# Altium project node24.PrjPcb (part 3 of 5)

## Sheet node24-ethernet.SchDoc: Ethernet
size Tabloid; Author: Emergence Team; Engineer: asheem; Organization: Emergence; Address1: Oakland, California; Address2: a@aliengeometry.com; Address3: Black Rock City '18; Address4: OPEN SOURCE H/W; DocumentNumber: 6; Revision: Rev 0.1; SheetNumber: 6; SheetTotal: 6; Project: NODE24
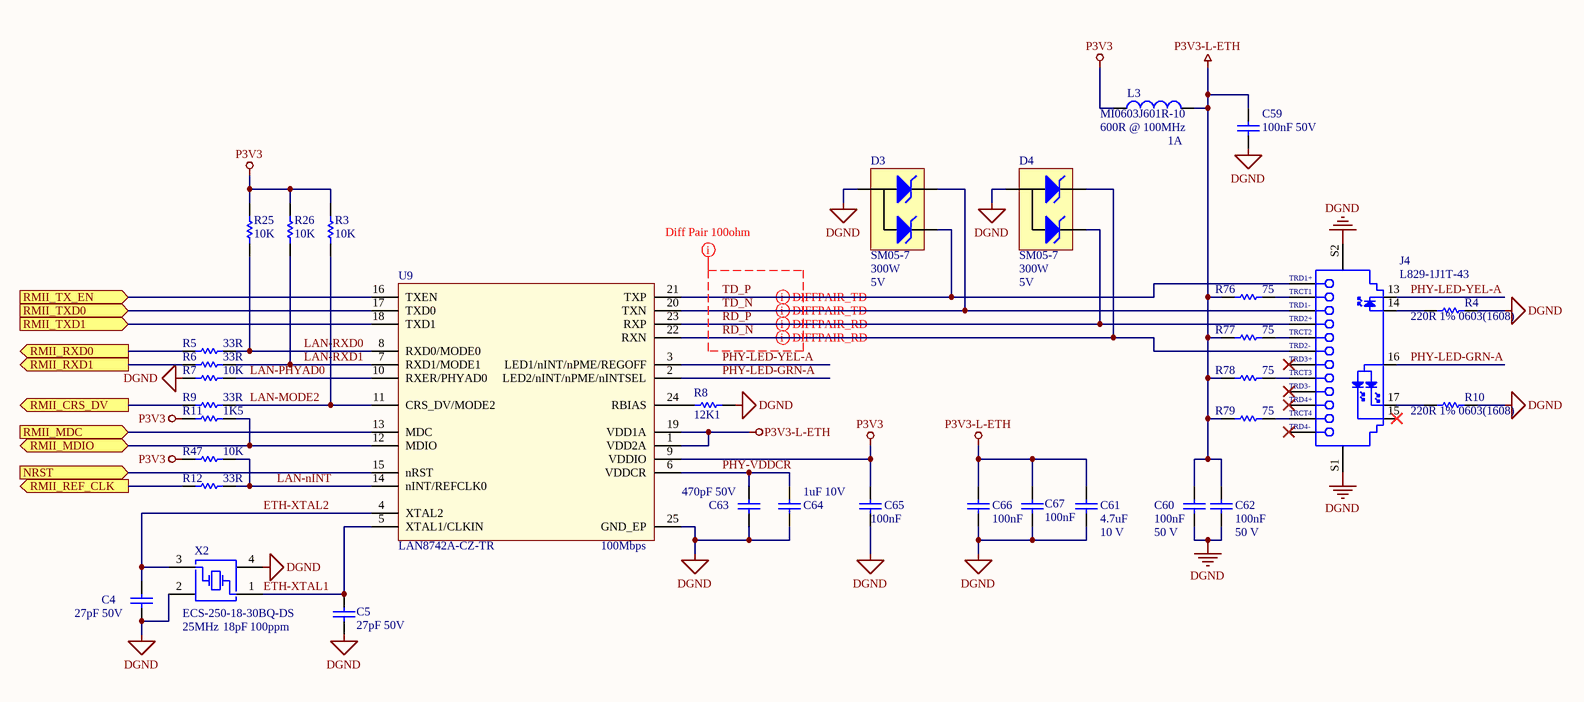
[diagram p2: node24-ethernet.SchDoc]

### Parts
C4  27pF 50V  [CAPC0603(1608)100_L]
C5  27pF 50V  [CAPC0603(1608)100_L]
C59  100nF 50V  [CAPC0603(1608)100_L]
C60  value 100nF  Rated Voltage: 50 V  [CAPC0603(1608)100_L]  (hidden comment: 100nF 50V)
C61  value 4.7uF  Rated Voltage: 10 V  [CAPC0603(1608)100_L]  (hidden comment: 4.7uF 10V)
C62  value 100nF  Rated Voltage: 50 V  [CAPC0603(1608)100_L]  (hidden comment: 100nF 50V)
C63  470pF 50V  [CAPC0603(1608)100_L]
C64  1uF 10V  [CAPC0603(1608)100_L]
C65  100nF  [CAPC0603(1608)100_L]
C66  100nF  [CAPC0603(1608)100_L]
C67  100nF  [CAPC0603(1608)100_L]
D3  Manufacturer Part Number: SM05-7  Max Power Dissipation: 300W  Reverse Standoff Voltage: 5V  [SOT-23]  (hidden comment: TVS_5V_DUAL_SOT23-3_SM05-7)
D4  Manufacturer Part Number: SM05-7  Max Power Dissipation: 300W  Reverse Standoff Voltage: 5V  [SOT-23]  (hidden comment: TVS_5V_DUAL_SOT23-3_SM05-7)
J4  L829-1J1T-43  [BELS-L829-1J1T-43_V]
L3  Manufacturer Part Number: MI0603J601R-10  Max DC Current: 1A  Impedance: 600R @ 100MHz  [0603L]  (hidden comment: BEAD_LAIRD_MI0603J601R-10)
R3  10K  [RESC0603(1608)_L]
R4  220R 1% 0603(1608)  [RESC0603(1608)_L]
R5  33R  [RESC0603(1608)_L]
R6  33R  [RESC0603(1608)_L]
R7  10K  [RESC0603(1608)_L]
R8  12K1  [RESC0603(1608)_L]
R9  33R  [RESC0603(1608)_L]
R10  220R 1% 0603(1608)  [RESC0603(1608)_L]
R11  1K5  [RESC0603(1608)_L]
R12  33R  [RESC0603(1608)_L]
R25  10K  [RESC0603(1608)_L]
R26  10K  [RESC0603(1608)_L]
R47  10K  [RESC0603(1608)_L]
R76  value 75  [RESC0603(1608)_M]  (hidden comment: 75R 1% 0603(1608))
R77  value 75  [RESC0603(1608)_M]  (hidden comment: 75R 1% 0603(1608))
R78  value 75  [RESC0603(1608)_M]  (hidden comment: 75R 1% 0603(1608))
R79  value 75  [RESC0603(1608)_M]  (hidden comment: 75R 1% 0603(1608))
U9  Data Rate: 100Mbps  [QFN24_B4X4_P0MM5_EP]  (hidden comment: LAN8742A-CZ-TR)
X2  Load Capacitance: 18pF  Frequency Stability: 100ppm  Frequency: 25MHz  Manufacturer Part Number: ECS-250-18-30BQ-DS  [XTAL_4SMD_5x3mm2]  (hidden comment: XTAL_25MHz_18PF_4SMD_100PPM_AUTOMOTIVE_ECS-250-18-30BQ-DS)

### Ports
NRST (in), RMII_CRS_DV (out), RMII_MDC (in), RMII_MDIO (bidir), RMII_REF_CLK (out), RMII_RXD0 (out), RMII_RXD1 (out), RMII_TX_EN (in), RMII_TXD0 (in), RMII_TXD1 (in)

### Nets
DGND: C4.2 C5.2 C59.1 C60.1 C61.2 C62.1 C63.1 C64.1 C65.1 C66.1 C67.1 D3.3(A) D4.3(A) J4.S1 J4.S2 R4.1 R7.2 R8.2 R10.1 U9.25(GND_EP) X2.2(CAN) X2.4(CAN)
P3V3: C65.2 L3.1 R3.2 R11.1 R25.2 R26.2 R47.2 U9.9(VDDIO)
P3V3-L-ETH: C59.2 C60.2 C61.1 C62.2 C66.2 C67.2 L3.2 R76.1 R77.1 R78.1 R79.1 U9.1(VDD2A) U9.19(VDD1A)
ETH-CRS-DV: R9.1 ; port RMII_CRS_DV
ETH-MDC: U9.13(MDC) ; port RMII_MDC
ETH-MDIO: R11.2 U9.12(MDIO) ; port RMII_MDIO
ETH-REF-CLK: R12.1 ; port RMII_REF_CLK
ETH-RXD0: R5.1 ; port RMII_RXD0
ETH-RXD1: R6.1 ; port RMII_RXD1
ETH-TX-EN: U9.16(TXEN) ; port RMII_TX_EN
ETH-TXD0: U9.17(TXD0) ; port RMII_TXD0
ETH-TXD1: U9.18(TXD1) ; port RMII_TXD1
ETH-XTAL1: C5.1 U9.5(XTAL1/CLKIN) X2.1(OSC1)
ETH-XTAL2: C4.1 U9.4(XTAL2) X2.3
LAN-MODE2: R3.1 R9.2 U9.11(CRS_DV/MODE2)
LAN-nINT: R12.2 R47.1 U9.14(nINT/REFCLK0)
LAN-PHYAD0: R7.1 U9.10(RXER/PHYAD0)
LAN-RXD0: R5.2 R25.1 U9.8(RXD0/MODE0)
LAN-RXD1: R6.2 R26.1 U9.7(RXD1/MODE1)
nRST: U9.15(nRST) ; port NRST
PHY-LED-GRN-A: J4.16 U9.2(LED2/nINT/nPME/nINTSEL)
PHY-LED-YEL-A: J4.13 U9.3(LED1/nINT/nPME/REGOFF)
PHY-VDDCR: C63.2 C64.2 U9.6(VDDCR)
RD_N: D4.1(K1) J4.6(TRD2-) U9.22(RXN)
RD_P: D4.2(K2) J4.4(TRD2+) U9.23(RXP)
TD_N: D3.1(K1) J4.3(TRD1-) U9.20(TXN)
TD_P: D3.2(K2) J4.1(TRD1+) U9.21(TXP)
NetJ4_2: J4.2(TRCT1) R76.2
NetJ4_5: J4.5(TRCT2) R77.2
NetJ4_8: J4.8(TRCT3) R78.2
NetJ4_11: J4.11(TRCT4) R79.2
NetJ4_14: J4.14 R4.2
NetJ4_17: J4.17 R10.2
NetR8_1: R8.1 U9.24(RBIAS)

Not connected (* = marked no-connect by the designer): J4 7(TRD3+)* 9(TRD3-)* 10(TRD4+)* 12(TRD4-)* 15*

### Layout directives
differential pair: RD_N, RD_P, TD_N, TD_P
rule Matched Net Lengths [Tolerance = 100mil]: RD_N, RD_P, TD_N, TD_P

### Notes on the sheet
- Title
- Size
- Date:
- Tabloid
- Number
- Engineer:
- Revision
- Sheet
- of
- File:
- SVN:

### Library data of the parts
C4 C5 = CMP-1035-00888-1: CAP 27pF 50V ±5% 0603 (1608 Metric) Thickness 1mm SMD; Case-Metric: 1608; Case-EIA: 0603; Tolerance: Â±5%; Technology: SMT; Value: 27pF; Rated Voltage: 50 V; Max Thickness: 1 mm
C59 C60 C62 C65-C67 = CMP-1035-02593-1: CAP 100nF 50V ±20% 0603 (1608 Metric) Thickness 1mm SMD; Tolerance: Â±20%; Case-EIA: 0603; Case-Metric: 1608; Max Thickness: 1 mm; Technology: SMT
  C59 C65-C67: Value: 100nF; Rated Voltage: 50 V
C61 = CMP-1035-02787-1: CAP 4.7uF 10V ±20% 0603 (1608 Metric) Thickness 1mm SMD; Case-EIA: 0603; Case-Metric: 1608; Tolerance: Â±20%; Max Thickness: 1 mm; Technology: SMT
C63 = CMP-1035-01677-1: CAP 470pF 50V ±20% 0603 (1608 Metric) Thickness 1mm SMD; Case-Metric: 1608; Tolerance: Â±20%; Case-EIA: 0603; Technology: SMT; Value: 470pF; Max Thickness: 1 mm; Rated Voltage: 50 V
C64 = CMP-1035-02734-1: CAP 1uF 10V ±20% 0603 (1608 Metric) Thickness 1mm SMD; Tolerance: Â±20%; Case-EIA: 0603; Case-Metric: 1608; Technology: SMT; Value: 1uF; Max Thickness: 1 mm; Rated Voltage: 10 V
D3 D4 = TVS_5V_DUAL_SOT23-3_SM05-7: TVS DIODE 5VWM 20.6VC SOT23; Manufacturer: Diodes; Direction: Unidirectional,Bidirectional; Element Configuration: Common Anode; Capacitance: 230pF; Number of Unidirectional Channels: 2; Clamping Voltage: 20.6V; Power Line Protection: No; Polarity: Unidirectional; Breakdown Voltage: 7.3V; Leakage Current: 10uA; ESD Protection: Yes; Test Current: 1mA; Peak Pulse Current: 17A; Min Breakdown Voltage: 6.2V; Supplier 1: Digi-Key; Stock 1: 20844; Pricing 1: 1=0.46, 10=0.341, 100=0.1932, 500=0.12792, 1000=0.09808 (USD); Mount: Surface Mount; Case/Package: SOT-23; Number of Pins: 3; Contact Plating: Tin,Matte; Min Operating Temperature: -55°C; Max Operating Temperature: 150°C; Package Quantity: 3000; Packaging: Tape and Reel; Peak Pulse Power: 300W; Termination: SMD/SMT; Working Voltage: 5V; Max Reverse Leakage Current: 10uA; Length: 2.9mm; Height: 1mm; Width: 1.3mm; Depth: 1.3mm; Radiation Hardening: No; Lead Free: Lead Free; ComponentLink1URL: https://datasheet.ciiva.com/333/ds31828-333314.pdf; ComponentLink1Description: https://datasheet.ciiva.com/333/ds31828-333314.pdf; ComponentLink2URL: https://datasheet.ciiva.com/15186/getdatasheetpartid-375729-15186470.pdf; ComponentLink2Description: https://datasheet.ciiva.com/15186/getdatasheetpartid-375729-15186470.pdf; ComponentLink3URL: https://datasheet.ciiva.com/25956/ds31828-25956699.pdf; ComponentLink3Description: https://datasheet.ciiva.com/25956/ds31828-25956699.pdf; ComponentLink4URL: https://datasheet.ciiva.com/13083/ds31828-89171-13083151.pdf; ComponentLink4Description: https://datasheet.ciiva.com/13083/ds31828-89171-13083151.pdf; Supplier Part Number 1: SM05-7DIDKR-ND
J4 = CMP-1715-00001-1: Gigabit MagJack(R) Ultra Low Profile, 10/100/1000 Base-T, 19-Pin THD, RoHS, Tray; Width: 24.13 mm; RoHSCompliant: True; PartNumber: L829-1J1T-43; Case/Package: Metal; Mount: Through Hole; ComponentLink1Description: Manufacturer URL; Height: 11.3 mm; Package Quantity: 60; Packaging: Tray; Length: 17.78 mm; PackageDescription: 19-Pin Through Hole Device, Body 23.94 x 17.58 mm, Pitch 2.03 mm; ComponentLink2URL: http://belfuse.com/pdfs/L829-1J1T-43.pdf; ComponentLink1URL: http://belfuse.com/ethernet/; Mounting Technology: Through Hole; DatasheetVersion: Rev. G; Pins: 8; ComponentLink2Description: Datasheet
L3 = BEAD_LAIRD_MI0603J601R-10: FERRITE BEAD 600 OHM 0603; Manufacturer: Laird; Number of Lines: 1; DC Resistance (DCR): 200mR; Test Frequency: 100MHz; Supplier 1: Digi-Key; Stock 1: 1193128; Pricing 1: 1=0.18, 10=0.148, 25=0.1152, 50=0.0952, 100=0.0822, 250=0.06572, 500=0.05914, 1000=0.04929 (USD); Mount: Surface Mount; Case/Package: 0603; Weight: 0.002oz; Case Code (Metric): 1608; Case Code (Imperial): 0603; Contact Plating: Tin,Matte; Core Material: Ferrite; Material: Ferrite; Min Operating Temperature: -40°C; Max Operating Temperature: 125°C; Packaging: Tape and Reel; Package Quantity: 1; Max Current Rating: 1A; Termination: SMD/SMT; Frequency: 100MHz; Current Rating: 1A; Length: 1.6mm; Height: 0.8mm; Width: 0.031inch; Depth: 0.8mm; Lead Free: Lead Free; REACH SVHC: Unknown; ComponentLink1URL: https://datasheet.ciiva.com/3082/mi0603j601r-10-a2-vp-3082208.pdf; ComponentLink1Description: https://datasheet.ciiva.com/3082/mi0603j601r-10-a2-vp-3082208.pdf; ComponentLink2URL: https://datasheet.ciiva.com/22650/1685984-22650402.pdf; ComponentLink2Description: https://datasheet.ciiva.com/22650/1685984-22650402.pdf; ComponentLink3URL: https://datasheet.ciiva.com/1013/mi0603j601r-10-1013257.pdf; ComponentLink3Description: https://datasheet.ciiva.com/1013/mi0603j601r-10-1013257.pdf; Supplier Part Number 1: 240-2371-6-ND
R3 R7 R25 R26 R47 = CMP-1012-00623-1: 10K 0.1W 1% 0603 (1608 Metric)  SMD; Value: 10000.00 Ohm; Case-EIA: 0603; Case-Metric: 1608; Power: 0.1 W; Tolerance: 1 %; Technology: SMT
R4 R10 = CMP-1012-00433-1: 220R 0.1W 1% 0603 (1608 Metric)  SMD; Value: 220.00 Ohm; Case-EIA: 0603; Case-Metric: 1608; Technology: SMT; Tolerance: 1 %; Power: 0.1 W
R5 R6 R9 R12 = CMP-1012-00341-1: 33R 0.1W 1% 0603 (1608 Metric)  SMD; Value: 33.00 Ohm; Case-EIA: 0603; Case-Metric: 1608; Tolerance: 1 %; Technology: SMT; Power: 0.1 W
R8 = CMP-1012-00632-1: 12K1 0.1W 1% 0603 (1608 Metric)  SMD; Case-Metric: 1608; Case-EIA: 0603; Value: 12100.00 Ohm; Power: 0.1 W; Technology: SMT; Tolerance: 1 %
R11 = CMP-1012-00528-1: 1K5 0.1W 1% 0603 (1608 Metric)  SMD; Case-EIA: 0603; Value: 1500.00 Ohm; Case-Metric: 1608; Power: 0.1 W; Technology: SMT; Tolerance: 1 %
R76-R79 = CMP-1012-00383-1: 75R 0.1W 1% 0603 (1608 Metric)  SMD; Case-EIA: 0603; Case-Metric: 1608; Power: 0.1 W; Technology: SMT; Tolerance: 1 %
U9 = IC_INTERFACE_ETHERNET_PHY_LAN8742A-CZ-TR: LAN8742A-CZ-TR - Small Footprint RMII 10/100 Ethernet, Transceiver with HP Auto-MDIX and flexPWR Technology SQFN-24; Manufacturer: Microchip; Max Supply Voltage: 3.3V; Min Supply Voltage: 1.8V; Number of Transceivers: 1; Supplier 1: Digi-Key; Stock 1: 3390; Pricing 1: 1=1.24, 25=1.03 (USD); Mount: Surface Mount; Case/Package: QFN; Number of Pins: 24; Min Operating Temperature: 0°C; Max Operating Temperature: 85°C; Package Quantity: 5000; Packaging: Tape and Reel; Radiation Hardening: No; ComponentLink1URL: https://datasheet.ciiva.com/29882/8742a-29882620.pdf; ComponentLink1Description: https://datasheet.ciiva.com/29882/8742a-29882620.pdf; Supplier Part Number 1: LAN8742A-CZ-CT-ND; Manufacturer Part Number: LAN8742A-CZ-TR
X2 = XTAL_25MHz_18PF_4SMD_100PPM_AUTOMOTIVE_ECS-250-18-30BQ-DS: Crystals 25.000MHz 18pF 100ppm -40 to 125C; Manufacturer: ECS International; ESR (Equivalent Series Resistance): 30R; Frequency Tolerance: 30ppm; Supplier 1: Digi-Key; Stock 1: 1363; Pricing 1: 1=1.2, 10=1.063, 50=0.9934, 100=0.8778, 500=0.8316 (USD); Mount: Surface Mount; Case/Package: SMD/SMT; Min Operating Temperature: -40°C; Max Operating Temperature: 125°C; Packaging: Tape and Reel; Package Quantity: 1000; Termination: SMD/SMT; Tolerance: 30ppm; Length: 0.197inch; Height: 0.033inch; Width: 3.2mm; ComponentLink1URL: https://datasheet.ciiva.com/18649/ecx-53bq-18649724.pdf; ComponentLink1Description: https://datasheet.ciiva.com/18649/ecx-53bq-18649724.pdf; ComponentLink2URL: https://datasheet.ciiva.com/18649/ecx-53bq-18649725.pdf; ComponentLink2Description: https://datasheet.ciiva.com/18649/ecx-53bq-18649725.pdf; ComponentLink3URL: https://datasheet.ciiva.com/18649/ecx-53bq-18649726.pdf; ComponentLink3Description: https://datasheet.ciiva.com/18649/ecx-53bq-18649726.pdf; Supplier Part Number 1: XC2003CT-ND

## Sheet node24-power.SchDoc: Power Management
size Tabloid; Author: Emergence Team; Engineer: asheem; Organization: Emergence; Address1: Oakland, California; Address2: a@aliengeometry.com; Address3: Black Rock City '18; Address4: OPEN SOURCE H/W; DocumentNumber: 5; Revision: Rev 0.1; SheetNumber: 5; SheetTotal: 6; Project: NODE24
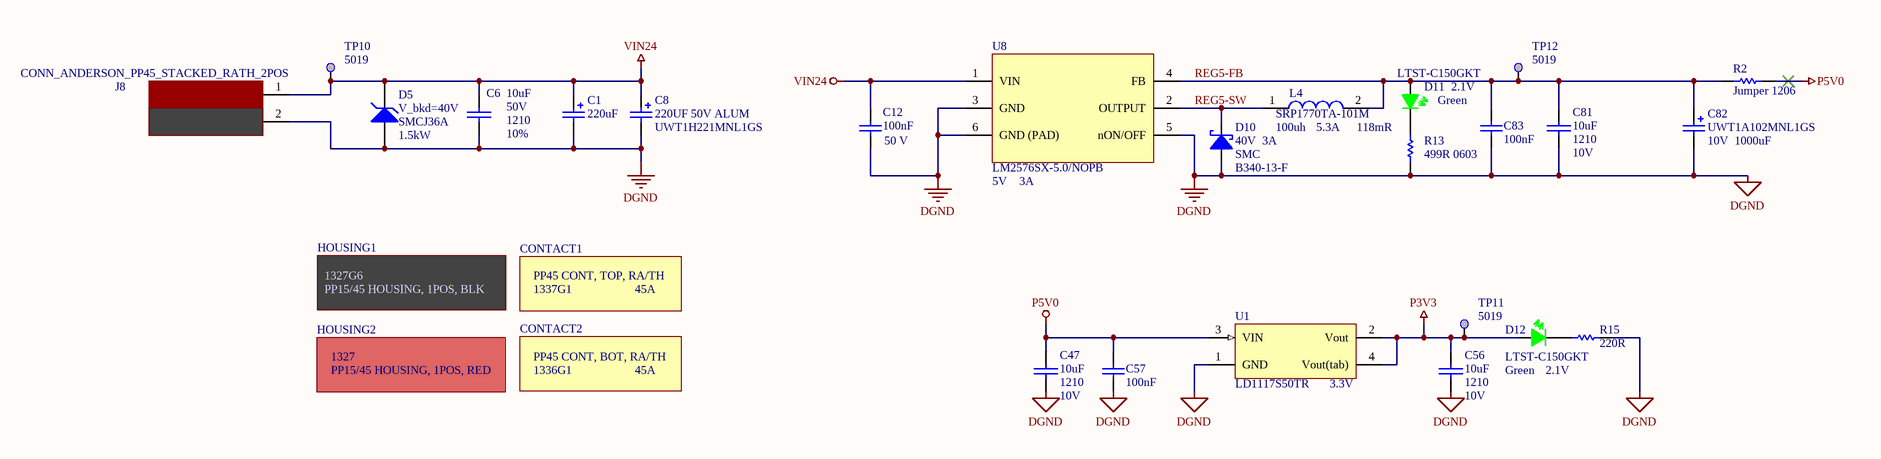
[diagram p3: node24-power.SchDoc]

### Parts
C1  Capacitance: 220uF  [CAPAE_D10_BH10MM3]  (hidden comment: 220UF ALUM 10MM)
C6  Tolerance: 10%  Voltage Rating: 50V  Capacitance: 10uF  Case/Package: 1210  [CAP1210]  (hidden comment: CAP_CER_10UF_50V_1210_GRJ32ER71H106KE11L)
C8  220UF 50V ALUM  Manufacturer Part Number: UWT1H221MNL1GS  [CAPAE_D10_BH10MM3]
C12  100nF  Rated Voltage: 50 V  [CAPC0603(1608)100_L]
C47  Capacitance: 10uF  Case/Package: 1210  Voltage Rating: 10V  [1210C]  (hidden comment: CAP_CER_10UF_1210_CL32B106KPINNNE)
C56  Capacitance: 10uF  Case/Package: 1210  Voltage Rating: 10V  [1210C]  (hidden comment: CAP_CER_10UF_1210_CL32B106KPINNNE)
C57  100nF  [CAPC0603(1608)100_L]
C81  Capacitance: 10uF  Case/Package: 1210  Voltage Rating: 10V  [1210C]  (hidden comment: CAP_CER_10UF_1210_CL32B106KPINNNE)
C82  Manufacturer Part Number: UWT1A102MNL1GS  Voltage: 10V  Capacitance: 1000uF  [CAPAE_D10_BH10MM3]  (hidden comment: CAP_ALUM_10V_1000UF_10MM_UWT1A102MNL1GS)
C83  100nF  [CAPC0603(1608)100_L]
CONTACT1  Current Rating: 45A  Manufacturer Part Number: 1337G1  Parameter 1: PP45 CONT, TOP, RA/TH  (hidden comment: CONN_ANDERSON_CONTACT_PP45_RATH_BOTTOM_1337G1)
CONTACT2  Parameter 1: PP45 CONT, BOT, RA/TH  Current Rating: 45A  Manufacturer Part Number: 1336G1  (hidden comment: CONN_ANDERSON_CONTACT_PP45_RATH_TOP_1336G1)
D5  Power Dissipation: 1.5kW  Manufacturer Part Number: SMCJ36A  Breakdown Voltage: V_bkd=40V  [DIODE_SMC]  (hidden comment: TVS_36V_1500W_SMC_SMCJ36A)
D10  Manufacturer Part Number: B340-13-F  Case/Package: SMC  Max Reverse Voltage (DC): 40V  Current: 3A  [DIODE_SMC]  (hidden comment: DIODE_SCHOTTKY_40V_3A_SMC_DIO_B340-13-F)
D11  Forward Voltage: 2.1V  Illumination Colour: Green  Manufacturer Part Number: LTST-C150GKT  [LED_1206]  (hidden comment: LED_LITEON_GREEN_1206_LTST-C150GKT)
D12  Forward Voltage: 2.1V  Illumination Colour: Green  Manufacturer Part Number: LTST-C150GKT  [LED_1206]  (hidden comment: LED_LITEON_GREEN_1206_LTST-C150GKT)
HOUSING1  Manufacturer Part Number: 1327G6  Parameter 1: PP15/45 HOUSING, 1POS, BLK  (hidden comment: CONN_ANDERSON_HOUSING_PP45/15_BLACK_1327G6)
HOUSING2  Manufacturer Part Number: 1327  Parameter 1: PP15/45 HOUSING, 1POS, RED  (hidden comment: CONN_ANDERSON_HOUSING_PP45/15_RED_1327)
J8  CONN_ANDERSON_PP45_STACKED_RATH_2POS  [CONN_ANDERSON_POWERPOLE_45_HOUSING_STACKED_RATH]
L4  Inductance: 100uh  DC Resistance (DCR): 118mR  Manufacturer Part Number: SRP1770TA-101M  Current Rating: 5.3A  [IND_17MM_SMT]  (hidden comment: IND_100UH_5A3_SRP1770TA-101M)
R2  Jumper 1206  [RESC1206(3216)_L]
R13  499R 0603  [RESC0603(1608)_L]
R15  220R  [RESC0603(1608)_L]
TP10  Manufacturer Part Number: 5019  [TEST_POINT_KEYSTONE_5019]  (hidden comment: TEST_POINT_KEYSTONE_5019_SMT)
TP11  Manufacturer Part Number: 5019  [TEST_POINT_KEYSTONE_5019]  (hidden comment: TEST_POINT_KEYSTONE_5019_SMT)
TP12  Manufacturer Part Number: 5019  [TEST_POINT_KEYSTONE_5019]  (hidden comment: TEST_POINT_KEYSTONE_5019_SMT)
U1  LD1117S50TR  Max Output Voltage: 3.3V  [SOT-223]
U8  Manufacturer Part Number: LM2576SX-5.0/NOPB  Output Voltage: 5V  Max Output Current: 3A  [D2PAK_TO-263-6]  (hidden comment: DCDC_TI_BUCK_REG_5V_3A_40VIN_D2PAK_LM2576SX-5.0/NOPB)

### Nets
DGND: C1.2 C6.2 C8.2 C12.2 C47.2 C56.2 C57.2 C81.2 C82.2 C83.2 D5.1(K) D10.1(A) J8.2 R13.2 R15.1 U1.1(GND) U8.3(GND) U8.5(nON/OFF) U8.6(GND_(PAD))
P3V3: C56.1 D12.1 TP11.1 U1.2(Vout) U1.4(Vout(tab))
P5V0: C47.1 C57.1 R2.2 U1.3(VIN)
VIN24: C1.1 C6.1 C8.1 C12.1 D5.2(A) J8.1 TP10.1 U8.1(VIN)
REG5-FB: C81.1 C82.1 C83.1 D11.1 L4.2 R2.1 TP12.1 U8.4(FB)
REG5-SW: D10.2(K) L4.1 U8.2(OUTPUT)
NetD11_2: D11.2 R13.1
NetD12_2: D12.2 R15.2

### Notes on the sheet
- Title
- Size
- Date:
- Tabloid
- Number
- Engineer:
- Revision
- Sheet
- of
- File:
- SVN:

### Library data of the parts
C1 C8 = CAP_ALUM_220UF_10MM_UWT1H221MNL1GS: CAP ALUM 220UF 20% 50V SMD; Manufacturer: Nichicon; Dielectric Material: Aluminium; Ripple Current: 220mA; Leakage Current: 3uA; Life (Hours): 1000Hour; Dissipation Factor: 0.14%; Supplier 1: Digi-Key; Stock 1: 57237; Pricing 1: 1=0.66, 10=0.464, 100=0.3058 (USD); Mount: Surface Mount; Case/Package: SMD/SMT; Number of Pins: 2; Temperature: -55~105C; Tolerance: 20%; Package Quantity: 500; Voltage Rating: 50V; Voltage Rating (DC): 50V; Packaging: Tape and Reel; Ripple Current (AC): 220mA; Termination: SMD/SMT; Voltage: 50V; Diameter: 10mm; Length: 10mm; Height: 10mm; Height - Seated (Max): 0.394inch; Lead Pitch: 4.5mm; Radiation Hardening: No; REACH SVHC: No SVHC; Lead Free: Lead Free; ComponentLink1URL: https://datasheet.ciiva.com/7781/e-wt-7781462.pdf; ComponentLink1Description: https://datasheet.ciiva.com/7781/e-wt-7781462.pdf; ComponentLink2URL: https://datasheet.ciiva.com/11686/e-wt-11686311.pdf; ComponentLink2Description: https://datasheet.ciiva.com/11686/e-wt-11686311.pdf; ComponentLink3URL: https://datasheet.ciiva.com/97/e-wt-97496.pdf; ComponentLink3Description: https://datasheet.ciiva.com/97/e-wt-97496.pdf; ComponentLink4URL: https://datasheet.ciiva.com/97/e-wt-97497.pdf; ComponentLink4Description: https://datasheet.ciiva.com/97/e-wt-97497.pdf; ComponentLink5URL: https://datasheet.ciiva.com/97/e-wt-97498.pdf; ComponentLink5Description: https://datasheet.ciiva.com/97/e-wt-97498.pdf; ComponentLink6URL: https://datasheet.ciiva.com/28458/1910938-28458474.pdf; ComponentLink6Description: https://datasheet.ciiva.com/28458/1910938-28458474.pdf; ComponentLink7URL: https://datasheet.ciiva.com/17526/e-wt-17526124.pdf; ComponentLink7Description: https://datasheet.ciiva.com/17526/e-wt-17526124.pdf; ComponentLink8URL: https://datasheet.ciiva.com/16502/e-wt-16502942.pdf; ComponentLink8Description: https://datasheet.ciiva.com/16502/e-wt-16502942.pdf; Supplier Part Number 1: 493-2228-6-ND
  C1: Manufacturer Part Number: UWT1H221MNL1GS
  C8: Capacitance: 220uF
C6 = CAP_CER_10UF_50V_1210_GRJ32ER71H106KE11L: 10µF 50V Ceramic Capacitor X7R 1210 (3225 Metric) 0.126" L x 0.098" W (3.20mm x 2.50mm); Manufacturer: Murata; Supplier 1: Digi-Key; Manufacturer Part Number: GRJ32ER71H106KE11L; Stock 1: 10000; Pricing 1: 1=1.03, 10=0.785, 100=0.5615, 500=0.4347 (USD); Mount: Surface Mount; Case Code (Metric): 3225; Case Code (Imperial): 1210; Min Operating Temperature: -55°C; Max Operating Temperature: 125°C; Packaging: Tape and Reel; Length: 0.126inch; Width: 0.098inch; Thickness: 0.11inch; ComponentLink1URL: http://search.murata.co.jp/Ceramy/image/img/A01X/partnumbering_e_01.pdf; ComponentLink1Description: http://search.murata.co.jp/Ceramy/image/img/A01X/partnumbering_e_01.pdf; ComponentLink2URL: https://www.murata.com/~/media/webrenewal/support/library/catalog/products/k70e.ashx; ComponentLink2Description: https://www.murata.com/~/media/webrenewal/support/library/catalog/products/k70e.ashx; Supplier Part Number 1: 490-10961-1-ND
C12 C57 C83 = CMP-1035-02593-1: as C59 on sheet node24-ethernet; Max Thickness: 1 mm; Value: 100nF; Technology: SMT
  C57 C83: Rated Voltage: 50 V
C47 C56 C81 = CAP_CER_10UF_1210_CL32B106KPINNNE: Cap Ceramic 10uF 10V X7R 10% SMD 1210 125C Embossed T/R; Manufacturer: Samsung; Supplier 1: Digi-Key; Manufacturer Part Number: CL32B106KPINNNE; Stock 1: 13080; Pricing 1: 1=0.36, 10=0.252, 100=0.1509, 500=0.1132, 1000=0.09559 (USD); Mount: Surface Mount; Case Code (Metric): 3225; Case Code (Imperial): 1210; Min Operating Temperature: -55°C; Max Operating Temperature: 125°C; Tolerance: 10%; Dielectric: X7R; Package Quantity: 2000; Packaging: Tape and Reel; Voltage Rating (DC): 10V; Length: 3.2mm; Height: 2mm; Depth: 2.5mm; Width: 0.098inch; Thickness: 0.087inch; Radiation Hardening: No; Lead Free: Lead Free; ComponentLink1URL: https://datasheet.ciiva.com/25792/cl32b106kpinnne-25792065.pdf; ComponentLink1Description: https://datasheet.ciiva.com/25792/cl32b106kpinnne-25792065.pdf; ComponentLink2URL: https://datasheet.ciiva.com/16437/cl05b104kq5nnnc-16437173.pdf; ComponentLink2Description: https://datasheet.ciiva.com/16437/cl05b104kq5nnnc-16437173.pdf; Supplier Part Number 1: 1276-3326-6-ND
C82 = CAP_ALUM_10V_1000UF_10MM_UWT1A102MNL1GS: CAP ALUM 1000UF 20% 10V SMD; Manufacturer: Nichicon; Dielectric Material: Aluminium; Ripple Current: 310mA; Leakage Current: 100uA; Life (Hours): 1000Hour; Lead Diameter: 1.1mm; Supplier 1: Digi-Key; Stock 1: 21953; Pricing 1: 1=0.66, 10=0.469, 100=0.3091 (USD); Mount: Surface Mount,PCB; Case/Package: Radial; Number of Pins: 2; Contact Plating: Tin; Min Operating Temperature: -55°C; Max Operating Temperature: 105°C; Tolerance: 20%; Packaging: Tape and Reel; Package Quantity: 500; Voltage Rating: 10V; Ripple Current (AC): 310mA; Voltage Rating (DC): 10V; Termination: SMD/SMT; Diameter: 10mm; Length: 10mm; Height: 10mm; Lead Pitch: 4.5mm; Height - Seated (Max): 0.394inch; Radiation Hardening: No; REACH SVHC: No SVHC; Lead Free: Lead Free; ComponentLink1URL: https://datasheet.ciiva.com/97/e-wt-97505.pdf; ComponentLink1Description: https://datasheet.ciiva.com/97/e-wt-97505.pdf; ComponentLink2URL: https://datasheet.ciiva.com/30522/getdatasheetpartid-388152-30522193.pdf; ComponentLink2Description: https://datasheet.ciiva.com/30522/getdatasheetpartid-388152-30522193.pdf; ComponentLink3URL: https://datasheet.ciiva.com/97/e-wt-97506.pdf; ComponentLink3Description: https://datasheet.ciiva.com/97/e-wt-97506.pdf; ComponentLink4URL: https://datasheet.ciiva.com/97/e-wt-97507.pdf; ComponentLink4Description: https://datasheet.ciiva.com/97/e-wt-97507.pdf; ComponentLink5URL: https://datasheet.ciiva.com/11776/0900766b80fa3a91-11776933.pdf; ComponentLink5Description: https://datasheet.ciiva.com/11776/0900766b80fa3a91-11776933.pdf; ComponentLink6URL: https://datasheet.ciiva.com/7793/e-wt-7793502.pdf; ComponentLink6Description: https://datasheet.ciiva.com/7793/e-wt-7793502.pdf; ComponentLink7URL: https://datasheet.ciiva.com/46384/1910938-46384607.pdf; ComponentLink7Description: https://datasheet.ciiva.com/46384/1910938-46384607.pdf; Supplier Part Number 1: 493-2171-6-ND
CONTACT1 = CONN_ANDERSON_CONTACT_PP45_RATH_BOTTOM_1337G1: Heavy Duty Power Connectors PCB45 HORIZ (TOP) RA LP CONT.; Manufacturer: Anderson Power; Voltage Rating: 250V; Gender: Female; Supplier 1: Mouser; Stock 1: 13219; Pricing 1: 1=0.58, 10=0.58, 50=0.467, 100=0.43, 1000=0.38, 10000=0.38 (USD); Mount: Through Hole; Contact Material: Copper,Copper Alloy; Contact Plating: Tin; Termination: Through Hole; REACH SVHC: No SVHC; ComponentLink1URL: https://datasheet.ciiva.com/18408/70162076-18408970.pdf; ComponentLink1Description: https://datasheet.ciiva.com/18408/70162076-18408970.pdf; Supplier Part Number 1: 879-1337G1
CONTACT2 = CONN_ANDERSON_CONTACT_PP45_RATH_TOP_1336G1: Heavy Duty Power Connectors PCB45 HORIZ. (BOT) RA LP CONT.; Manufacturer: Anderson Power; Voltage Rating: 250V; Gender: Female; Supplier 1: Mouser; Stock 1: 32882; Pricing 1: 1=0.57, 10=0.57, 50=0.501, 100=0.448, 1000=0.373, 10000=0.373 (USD); Mount: Through Hole; Contact Material: Copper,Copper Alloy; Contact Plating: Tin; Termination: Through Hole; REACH SVHC: No SVHC; ComponentLink1URL: https://datasheet.ciiva.com/18408/70162076-18408966.pdf; ComponentLink1Description: https://datasheet.ciiva.com/18408/70162076-18408966.pdf; Supplier Part Number 1: 879-1336G1
D5 = TVS_36V_1500W_SMC_SMCJ36A: TVS DIODE 36VWM 58.1VC SMC; Manufacturer: Littelfuse; Direction: Unidirectional; Reverse Breakdown Voltage: 40V; Operating Supply Voltage: 36V; Max Surge Current: 25.9A; Number of Elements: 1; Clamping Voltage: 58.1V; Power Line Protection: No; Test Current: 1mA; Max Breakdown Voltage: 44.2V; Max Reverse Leakage Current: 1uA; Max Power Dissipation: 6.5W; Element Configuration: Single; Supplier 1: Digi-Key; Stock 1: 19790; Pricing 1: 1=0.61, 10=0.513, 25=0.4488, 100=0.3846, 250=0.33332, 500=0.28206, 1000=0.21795 (USD); Mount: Surface Mount; Case/Package: SMC; Number of Pins: 2; Min Operating Temperature: -65°C; Max Operating Temperature: 150°C; Package Quantity: 3000; Packaging: Tape and Reel; Number of Channels: 1; Polarity: Unidirectional; Peak Pulse Power: 1.5kW; Termination: SMD/SMT; Number of Unidirectional Channels: 1; Reverse Standoff Voltage: 36V; Min Breakdown Voltage: 40V; Peak Pulse Current: 25.9A; Leakage Current: 1uA; Voltage Rating (DC): 36V; Length: 7.11mm; Height: 2.417mm; Width: 6.22mm; Radiation Hardening: No; REACH SVHC: No SVHC; Lead Free: Lead Free; ComponentLink1URL: https://datasheet.ciiva.com/14162/smcj-eng-ds-14162005.pdf; ComponentLink1Description: https://datasheet.ciiva.com/14162/smcj-eng-ds-14162005.pdf; ComponentLink2URL: https://datasheet.ciiva.com/26943/getdatasheetpartid-214039-26943381.pdf; ComponentLink2Description: https://datasheet.ciiva.com/26943/getdatasheetpartid-214039-26943381.pdf; ComponentLink3URL: https://datasheet.ciiva.com/4510/littelfuse-tvs-diode-smcj-62645-4510614.pdf; ComponentLink3Description: https://datasheet.ciiva.com/4510/littelfuse-tvs-diode-smcj-62645-4510614.pdf; ComponentLink4URL: https://datasheet.ciiva.com/16487/littelfuse-tvs-diode-smcj-16487798.pdf; ComponentLink4Description: https://datasheet.ciiva.com/16487/littelfuse-tvs-diode-smcj-16487798.pdf; ComponentLink5URL: https://datasheet.ciiva.com/8062/littelfuse-tvs-diode-smcj-8062391.pdf; ComponentLink5Description: https://datasheet.ciiva.com/8062/littelfuse-tvs-diode-smcj-8062391.pdf; ComponentLink6URL: https://datasheet.ciiva.com/332/littelfuse-tvs-diode-smcj-datasheet-pdf-332153.pdf; ComponentLink6Description: https://datasheet.ciiva.com/332/littelfuse-tvs-diode-smcj-datasheet-pdf-332153.pdf; ComponentLink7URL: https://datasheet.ciiva.com/332/littelfuse-tvs-diode-smcj-datasheet-pdf-332154.pdf; ComponentLink7Description: https://datasheet.ciiva.com/332/littelfuse-tvs-diode-smcj-datasheet-pdf-332154.pdf; ComponentLink8URL: https://datasheet.ciiva.com/332/littelfuse-tvs-diode-smcj-datasheet-pdf-332155.pdf; ComponentLink8Description: https://datasheet.ciiva.com/332/littelfuse-tvs-diode-smcj-datasheet-pdf-332155.pdf; ComponentLink9URL: https://datasheet.ciiva.com/46385/607636-46385086.pdf; ComponentLink9Description: https://datasheet.ciiva.com/46385/607636-46385086.pdf; Supplier Part Number 1: SMCJ36ALFCT-ND
D10 = DIODE_SCHOTTKY_40V_3A_SMC_DIO_B340-13-F: DIODE SCHOTTKY 40V 3A SMC; Manufacturer: Diodes; Peak Reverse Current: 500uA; Forward Voltage: 500mV; Max Forward Surge Current (Ifsm): 100A; Element Configuration: Single; Polarity: Standard; Capacitance: 250pF; Supplier 1: Digi-Key; Stock 1: 14507; Pricing 1: 1=0.39, 10=0.32, 100=0.2175, 500=0.16316, 1000=0.12236 (USD); Mount: Surface Mount; Number of Pins: 2; Weight: 0.007408oz; Min Operating Temperature: -55°C; Max Operating Temperature: 125°C; Package Quantity: 3000; Packaging: Tape and Reel; Forward Current: 3A; Average Rectified Current: 3A; Max Repetitive Reverse Voltage (Vrrm): 40V; Peak Non-Repetitive Surge Current: 100A; Termination: SMD/SMT; Voltage Rating (DC): 40V; Current Rating: 3A; Output Current: 3A; Voltage: 40V; Length: 7.11mm; Height: 2.5mm; Width: 6.22mm; Radiation Hardening: No; REACH SVHC: No SVHC; Lead Free: Lead Free; ComponentLink1URL: https://datasheet.ciiva.com/914/ds30923-914112.pdf; ComponentLink1Description: https://datasheet.ciiva.com/914/ds30923-914112.pdf; ComponentLink2URL: https://datasheet.ciiva.com/16291/ds13005-16291142.pdf; ComponentLink2Description: https://datasheet.ciiva.com/16291/ds13005-16291142.pdf; ComponentLink3URL: https://datasheet.ciiva.com/26949/getdatasheetpartid-116064-26949351.pdf; ComponentLink3Description: https://datasheet.ciiva.com/26949/getdatasheetpartid-116064-26949351.pdf; Supplier Part Number 1: B340-FDIDKR-ND
D11 D12 = LED_LITEON_GREEN_1206_LTST-C150GKT: LED GREEN CLEAR 1206 SMD; Manufacturer: Vishay Lite-On; Lens Colour: Clear,Colorless; Max Power Dissipation: 100mW; Luminous Intensity: 6mcd; Forward Current: 30mA; Viewing Angle: 130°; Lens Style: Clear,Diffused,Colorless,Rectangular; Dominant Wavelength: 569nm; Test Current: 10mA; Number of Elements: 1; Wavelength: 565nm; Reverse Voltage: 5V; Supplier 1: Digi-Key; Stock 1: 0; Mount: Surface Mount; Case/Package: 1206; Number of Pins: 2; Colour: Green; Case Code (Metric): 3216; Case Code (Imperial): 1206; Min Operating Temperature: -55°C; Max Operating Temperature: 85°C; Packaging: Tape and Reel; Package Quantity: 1; Power Rating: 100mW; Lens Transparency: Clear; Power Dissipation: 100mW; Number of LEDs: 1; Length: 3.2mm; Height: 1.1mm; Width: 1.6mm; Depth: 1.6mm; Radiation Hardening: No; Lead Free: Lead Free; ComponentLink1URL: https://datasheet.ciiva.com/2110/ltst-c150gkt-2110032.pdf; ComponentLink1Description: https://datasheet.ciiva.com/2110/ltst-c150gkt-2110032.pdf; ComponentLink2URL: https://datasheet.ciiva.com/12400/lite-on-ltst-c150gkt-187412-12400912.pdf; ComponentLink2Description: https://datasheet.ciiva.com/12400/lite-on-ltst-c150gkt-187412-12400912.pdf; ComponentLink3URL: https://datasheet.ciiva.com/11775/0900766b80dc0263-11775637.pdf; ComponentLink3Description: https://datasheet.ciiva.com/11775/0900766b80dc0263-11775637.pdf; ComponentLink4URL: https://datasheet.ciiva.com/4266/s-110-ltst-c150gkt-4266310.pdf; ComponentLink4Description: https://datasheet.ciiva.com/4266/s-110-ltst-c150gkt-4266310.pdf; ComponentLink5URL: https://datasheet.ciiva.com/16375/ltst-c150gkt-16375926.pdf; ComponentLink5Description: https://datasheet.ciiva.com/16375/ltst-c150gkt-16375926.pdf; ComponentLink6URL: https://datasheet.ciiva.com/15117/getdatasheetpartid-142080-15117739.pdf; ComponentLink6Description: https://datasheet.ciiva.com/15117/getdatasheetpartid-142080-15117739.pdf; Supplier Part Number 1: 160-1169-6-ND
HOUSING1 = CONN_ANDERSON_HOUSING_PP45/15_BLACK_1327G6: Heavy Duty Power Connectors PP15/45 HOUSING ONLY BLACK; Manufacturer: Anderson Power; Voltage Rating: 600V; Number of Contacts: 1; Gender: Male; Current Rating: 15A; Voltage Rating (DC): 45V; Connector Type: Plug,Socket; Wire Gauge (Max): 20AWG; Wire Gauge (Min): 16AWG; Supplier 1: Mouser; Stock 1: 41587; Pricing 1: 1=0.46, 10=0.46, 50=0.395, 100=0.341, 1000=0.299, 10000=0.299 (USD); Mount: Panel; Housing Colour: Black; Colour: Black; Housing Material: Polycarbonate; Contact Plating: Tin,Silver,Matte; Min Operating Temperature: -20°C; Max Operating Temperature: 105°C; Number of Rows: 1; Orientation: Straight; Number of Positions: 1; Length: 7.9mm; Depth: 24.6mm; Flammability Rating: UL94 V-0; REACH SVHC: No SVHC; ComponentLink1URL: https://datasheet.ciiva.com/7630/90775-7630279.pdf; ComponentLink1Description: https://datasheet.ciiva.com/7630/90775-7630279.pdf; ComponentLink2URL: https://datasheet.ciiva.com/11726/0900766b811db648-11726635.pdf; ComponentLink2Description: https://datasheet.ciiva.com/11726/0900766b811db648-11726635.pdf; ComponentLink3URL: https://datasheet.ciiva.com/14616/70237089-14616588.pdf; ComponentLink3Description: https://datasheet.ciiva.com/14616/70237089-14616588.pdf; ComponentLink4URL: https://datasheet.ciiva.com/14154/04211009-14154461.pdf; ComponentLink4Description: https://datasheet.ciiva.com/14154/04211009-14154461.pdf; Supplier Part Number 1: 879-1327G6
HOUSING2 = CONN_ANDERSON_HOUSING_PP45/15_RED_1327: CONNECTOR HOUSING, 1POS, RED; Manufacturer: Anderson Power; Voltage Rating: 600V; Number of Contacts: 1; Gender: Receptacle; Current Rating: 15A; Voltage Rating (DC): 45V; Wire Gauge (Max): 20AWG; Wire Gauge (Min): 16AWG; Supplier 1: Mouser; Stock 1: 50357; Pricing 1: 1=0.43, 10=0.43, 50=0.384, 100=0.331, 1000=0.289, 10000=0.289 (USD); Mount: Panel; Housing Colour: Red; Colour: Red; Housing Material: Polycarbonate; Min Operating Temperature: -20°C; Max Operating Temperature: 105°C; Number of Rows: 1; Orientation: Straight; Length: 7.9mm; Depth: 24.6mm; Flammability Rating: UL94 V-0; REACH SVHC: No SVHC; ComponentLink1URL: https://datasheet.ciiva.com/1114/1682359-1114016.pdf; ComponentLink1Description: https://datasheet.ciiva.com/1114/1682359-1114016.pdf; ComponentLink2URL: https://datasheet.ciiva.com/11726/0900766b811db648-11726624.pdf; ComponentLink2Description: https://datasheet.ciiva.com/11726/0900766b811db648-11726624.pdf; ComponentLink3URL: https://datasheet.ciiva.com/14616/70162007-14616653.pdf; ComponentLink3Description: https://datasheet.ciiva.com/14616/70162007-14616653.pdf; ComponentLink4URL: https://datasheet.ciiva.com/26927/getdatasheetpartid-423519-26927565.pdf; ComponentLink4Description: https://datasheet.ciiva.com/26927/getdatasheetpartid-423519-26927565.pdf; ComponentLink5URL: https://datasheet.ciiva.com/14154/04211009-14154462.pdf; ComponentLink5Description: https://datasheet.ciiva.com/14154/04211009-14154462.pdf; Supplier Part Number 1: 879-1327
J8 = CONN_ANDERSON_PP45_STACKED_RATH_2POS: Powerpole PP15/45, Stacked 2pos; Manufacturer Part Number: See other parts for component data
L4 = IND_100UH_5A3_SRP1770TA-101M: Surface Mount Power Inductor, SRP1770TA Series, 100UH, 5.3 A, 12 A, Shielded, 0.118 ohm; Manufacturer: Bourns; Core Material: Carbonyl Powder; Saturation Current: 6.5A; Self Resonant Frequency: 2MHz; Test Frequency: 100kHz; Tolerance: 20%; Supplier 1: Digi-Key; Stock 1: 2886; Pricing 1: 1=3.88, 10=3.558, 100=2.3288 (USD); Mount: Surface Mount; Case/Package: Nonstandard; Min Operating Temperature: -40°C; Max Operating Temperature: 150°C; Packaging: Cut Tape; Composition: Wirewound; Shielding: Shielded; RMS Current (Irms): 5.3A; Inductance Tolerance: 20%; Length: 0.666inch; Width: 0.666inch; Height - Seated (Max): 0.276inch; REACH SVHC: No SVHC; ComponentLink1URL: http://www.farnell.com/datasheets/1955470.pdf; ComponentLink1Description: http://www.farnell.com/datasheets/1955470.pdf; ComponentLink2URL: http://www.bourns.com/docs/Product-Datasheets/SRP1770TA.pdf; ComponentLink2Description: http://www.bourns.com/docs/Product-Datasheets/SRP1770TA.pdf; Supplier Part Number 1: SRP1770TA-101MDKR-ND
R2 = CMP-1014-00001-1: Jumper 1206 (3216 Metric); Tolerance: None; Case-EIA: 1206; Case-Metric: 3216; Value: 0.00 Ohm; Technology: SMT; Power: None
R13 = CMP-1012-00476-1: 499R 0.1W 1% 0603 (1608 Metric)  SMD; Case-Metric: 1608; Case-EIA: 0603; Value: 499.00 Ohm; Technology: SMT; Power: 0.1 W; Tolerance: 1 %
R15 = CMP-1012-00433-1: as R4 on sheet node24-ethernet; Technology: SMT; Tolerance: 1 %; Power: 0.1 W
TP10-TP12 = TEST_POINT_KEYSTONE_5019_SMT: Circuit Board Hardware - PCB TEST POINT; Manufacturer: Keystone Electronics; Supplier 1: Digi-Key; Stock 1: 207442; Pricing 1: 1=0.38, 10=0.355, 25=0.3044, 50=0.2586, 100=0.2485, 250=0.22316, 500=0.21302 (USD); Mount: Surface Mount,PCB; Number of Pins: 1; Contact Plating: Silver; Material: Bronze; Contact Material: Bronze; Packaging: Tape and Reel; Package Quantity: 1; Termination: SMD/SMT; Height: 0.09inch; REACH SVHC: No SVHC; Lead Free: Lead Free; ComponentLink1URL: https://datasheet.ciiva.com/14848/m60-2p61-14848437.pdf; ComponentLink1Description: https://datasheet.ciiva.com/14848/m60-2p61-14848437.pdf; ComponentLink2URL: https://datasheet.ciiva.com/14848/m60-2p61-14848438.pdf; ComponentLink2Description: https://datasheet.ciiva.com/14848/m60-2p61-14848438.pdf; ComponentLink3URL: https://datasheet.ciiva.com/14848/m60-2p61-14848439.pdf; ComponentLink3Description: https://datasheet.ciiva.com/14848/m60-2p61-14848439.pdf; ComponentLink4URL: https://datasheet.ciiva.com/16885/70182998-16885945.pdf; ComponentLink4Description: https://datasheet.ciiva.com/16885/70182998-16885945.pdf; ComponentLink5URL: https://datasheet.ciiva.com/16318/m60-2p61-16318395.pdf; ComponentLink5Description: https://datasheet.ciiva.com/16318/m60-2p61-16318395.pdf; Supplier Part Number 1: 36-5019CT-ND
U1 = LDO_ST_3V3_950mA_LD1117: Fixed LDO Voltage Regulator, 5.3V to 15V, 1.1V Dropout, 3.3Vout, 950mAout, SOT-223-4; Manufacturer: STMicroelectronics; Manufacturer Part Number: LD1117S33CTR; Number of Outputs: 1; Output Current: 950mA; Max Output Current: 1.3A; Max Power Dissipation: 12W; Input Bias Current: 5mA; Polarity: Positive; Quiescent Current: 10mA; Accuracy: 1%; Supplier 1: Digi-Key; Stock 1: 0; Pricing 1: 1=0.42, 10=0.361, 100=0.2697, 500=0.21188, 1000=0.16373 (USD); Mount: Surface Mount; Case/Package: SOT-223; Number of Pins: 4; Weight: 0.01lb; Number of Terminals: 4; Contact Plating: Tin,Matte; Min Operating Temperature: -40°C; Max Operating Temperature: 125°C; Output Voltage: 3.3V; Packaging: Tape and Reel; Min Input Voltage: 5.3V; Dropout Voltage: 1.1V; Nominal Output Voltage: 3.3V; Max Input Voltage: 15V; Package Quantity: 1; Max Supply Voltage: 15V; Min Supply Voltage: 3.3V; Number of Regulators: 1; Min Output Voltage: 3.3V; Power Dissipation: 12W; Termination: SMD/SMT; Output Voltage Accuracy: 1%; Length: 6.5mm; Height: 1.8mm; Width: 3.5mm; Radiation Hardening: No; REACH SVHC: No SVHC; Lead Free: Lead Free; ComponentLink1URL: https://datasheet.ciiva.com/1511/1776449-1511572.pdf; ComponentLink1Description: https://datasheet.ciiva.com/1511/1776449-1511572.pdf; ComponentLink2URL: https://datasheet.ciiva.com/16392/cd00000544-16392069.pdf; ComponentLink2Description: https://datasheet.ciiva.com/16392/cd00000544-16392069.pdf; ComponentLink3URL: https://datasheet.ciiva.com/19480/1390223-19480586.pdf; ComponentLink3Description: https://datasheet.ciiva.com/19480/1390223-19480586.pdf; ComponentLink4URL: https://datasheet.ciiva.com/2041/cd00000544-2041932.pdf; ComponentLink4Description: https://datasheet.ciiva.com/2041/cd00000544-2041932.pdf; ComponentLink5URL: https://datasheet.ciiva.com/7992/1776449-7992620.pdf; ComponentLink5Description: https://datasheet.ciiva.com/7992/1776449-7992620.pdf; ComponentLink6URL: https://datasheet.ciiva.com/2041/cd00000544-2041933.pdf; ComponentLink6Description: https://datasheet.ciiva.com/2041/cd00000544-2041933.pdf; ComponentLink7URL: https://datasheet.ciiva.com/2041/cd00000544-2041934.pdf; ComponentLink7Description: https://datasheet.ciiva.com/2041/cd00000544-2041934.pdf; Supplier Part Number 1: 497-1241-6-ND
U8 = DCDC_TI_BUCK_REG_5V_3A_40VIN_D2PAK_LM2576SX-5.0/NOPB: Conv DC-DC Single Non-Inv/Inv/Step Up/Step Down 4V to 40V 6-Pin(5+Tab) TO-263 T/R; Manufacturer: TI National Semiconductor; Number of Outputs: 1; Efficiency: 77%; Switching Frequency: 58kHz; Synchronous Rectifier: No; Quiescent Current: 5mA; Supplier 1: Digi-Key; Stock 1: 24779; Pricing 1: 1=2.86, 10=2.567, 100=2.1029 (USD); Mount: Surface Mount; Case/Package: TO-263; Number of Pins: 5; Contact Plating: Tin; Min Operating Temperature: -40°C; Max Operating Temperature: 125°C; Nominal Output Voltage: 5V; Packaging: Tape and Reel; Output Current: 3A; Min Input Voltage: 4V; Max Input Voltage: 40V; Package Quantity: 500; Operating Supply Voltage: 40V; Radiation Hardening: No; REACH SVHC: No SVHC; Lead Free: Contains Lead; ComponentLink1URL: https://datasheet.ciiva.com/3219/lm2576-3219929.pdf; ComponentLink1Description: https://datasheet.ciiva.com/3219/lm2576-3219929.pdf; ComponentLink2URL: https://datasheet.ciiva.com/15112/getdatasheetpartid-91773-15112843.pdf; ComponentLink2Description: https://datasheet.ciiva.com/15112/getdatasheetpartid-91773-15112843.pdf; ComponentLink3URL: https://datasheet.ciiva.com/41457/001013741-da-01-en-ic-reg-bu-lm2576sx-5-0-nopb-to-263-5-tid-41457614.pdf; ComponentLink3Description: https://datasheet.ciiva.com/41457/001013741-da-01-en-ic-reg-bu-lm2576sx-5-0-nopb-to-263-5-tid-41457614.pdf; Supplier Part Number 1: LM2576SX-5.0/NOPBDKR-ND